# Altium project IM_v1.0.PrjPcb (part 2 of 2)

## Sheet MCU.SchDoc
size A3; SheetNumber: 4; SheetTotal: 8
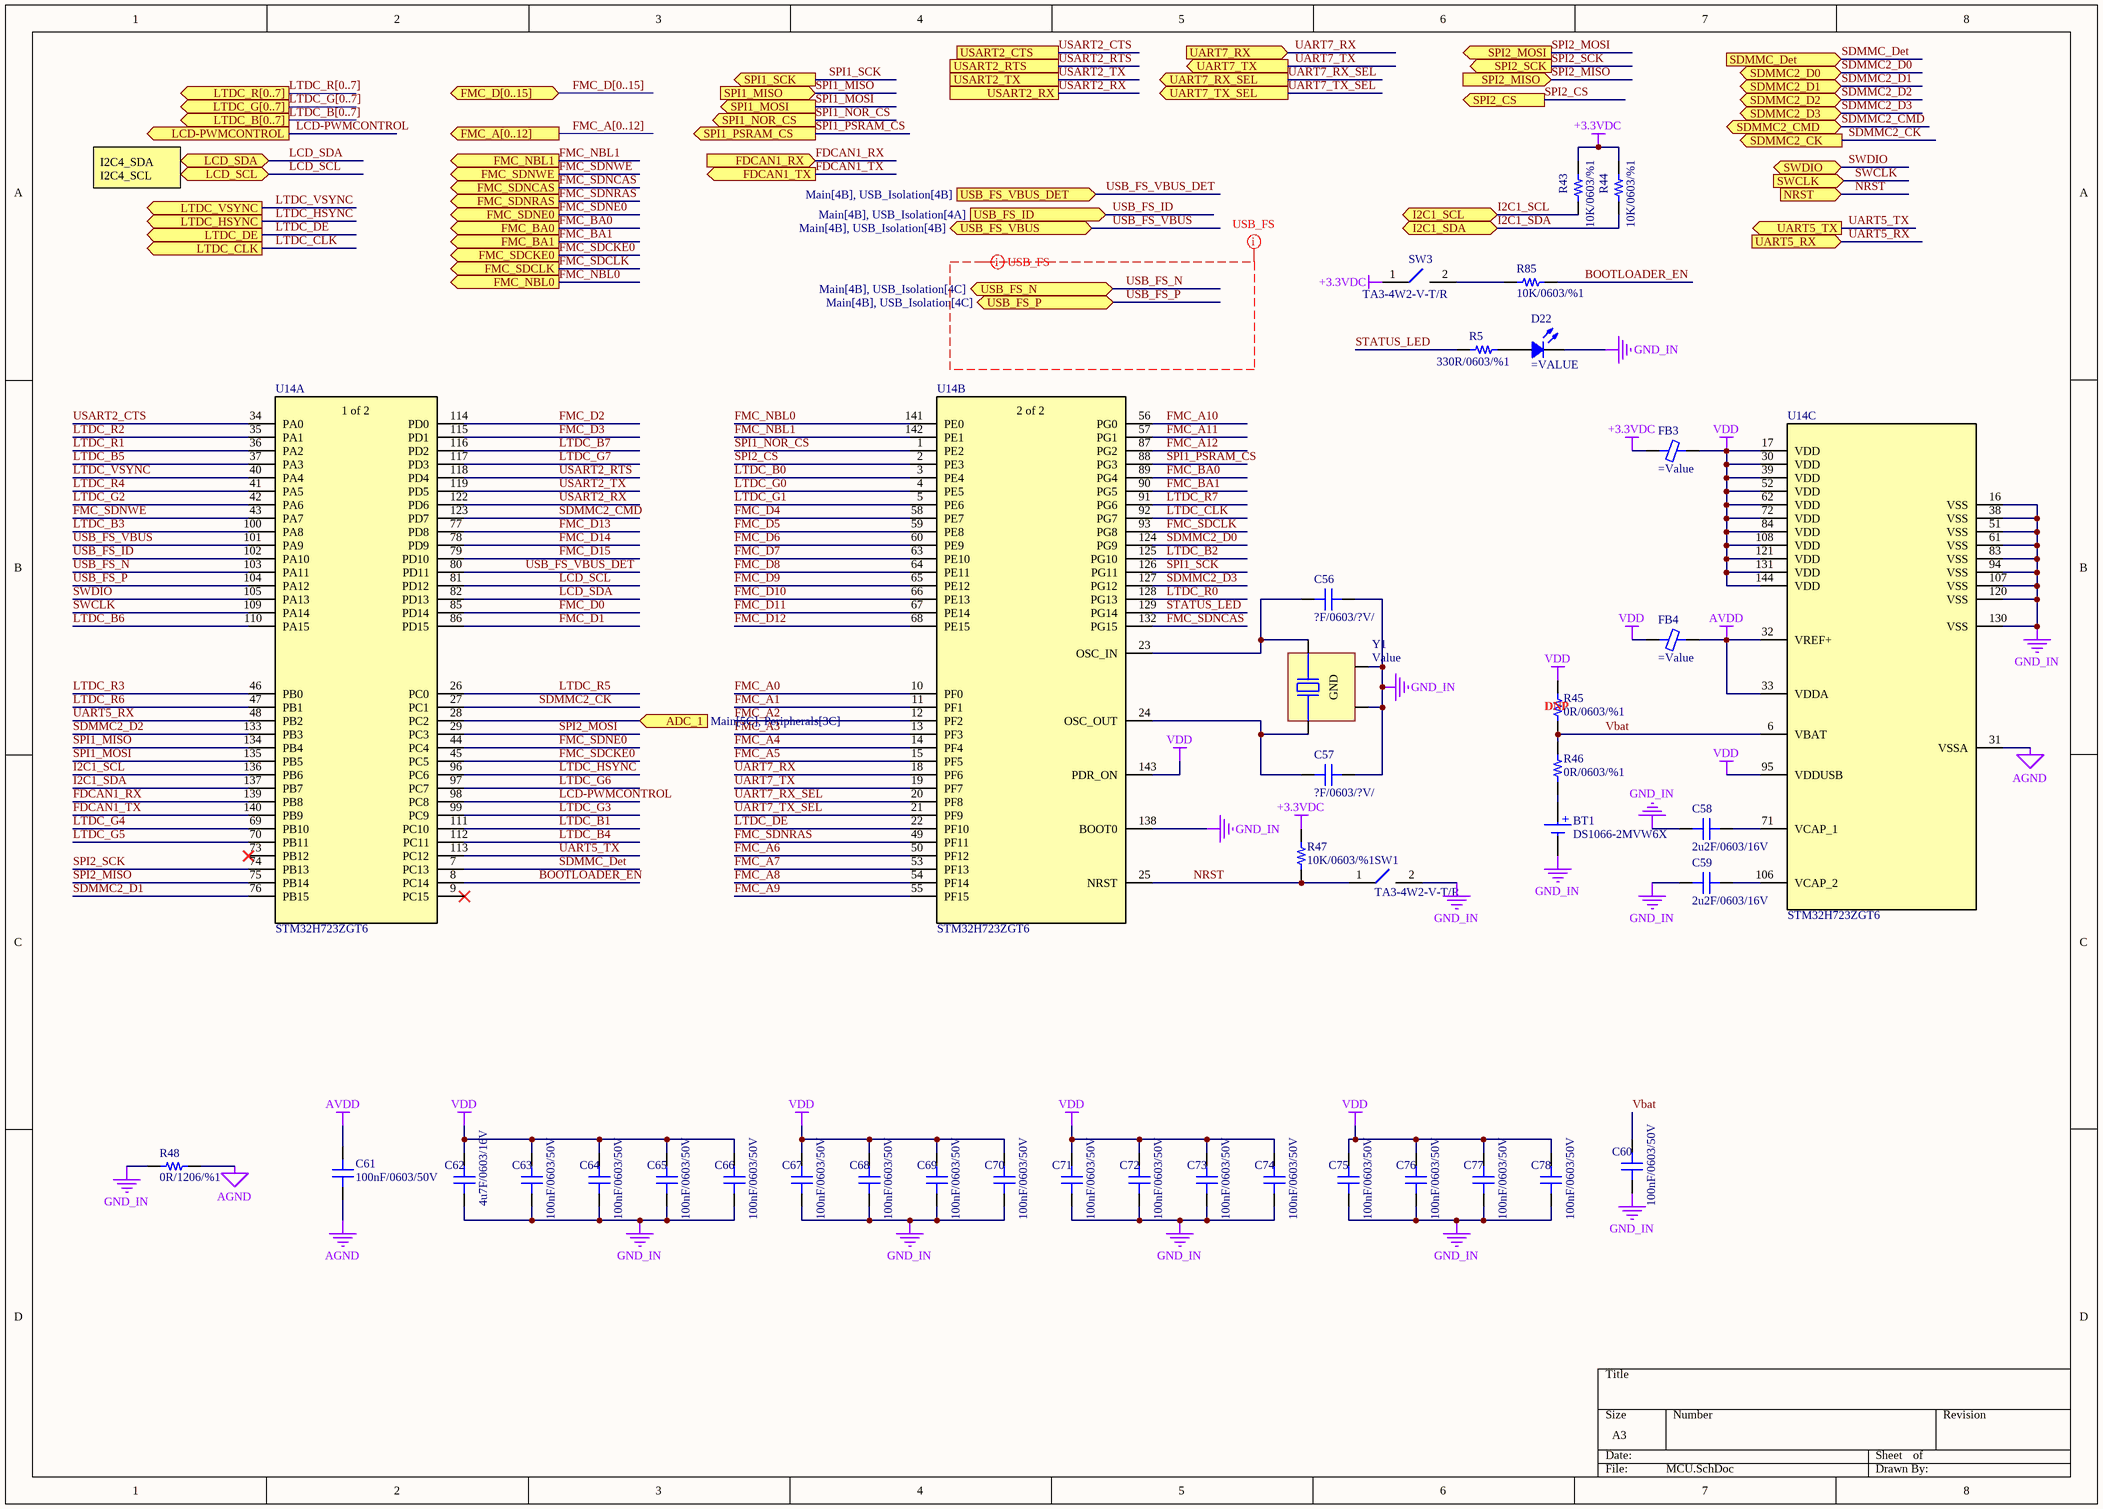
[diagram p7: MCU.SchDoc]

### Parts
(Parts that share a designator on the sheet are numbered #1, #2 ... from top to bottom, then left to right.)
BT1  DS1066-2MVW6X  [batt_conn]
C56  ?F/0603/?V/  [0603_cap]
C57  ?F/0603/?V/  [0603_cap]
C58  2u2F/0603/16V  [0603_cap]
C59  2u2F/0603/16V  [0603_cap]
C60  100nF/0603/50V  [0603_cap]
C61  100nF/0603/50V  [0603_cap]
C62  4u7F/0603/16V  [0603_cap]
C63  100nF/0603/50V  [0603_cap]
C64  100nF/0603/50V  [0603_cap]
C65  100nF/0603/50V  [0603_cap]
C66  100nF/0603/50V  [0603_cap]
C67  100nF/0603/50V  [0603_cap]
C68  100nF/0603/50V  [0603_cap]
C69  100nF/0603/50V  [0603_cap]
C70  100nF/0603/50V  [0603_cap]
C71  100nF/0603/50V  [0603_cap]
C72  100nF/0603/50V  [0603_cap]
C73  100nF/0603/50V  [0603_cap]
C74  100nF/0603/50V  [0603_cap]
C75  100nF/0603/50V  [0603_cap]
C76  100nF/0603/50V  [0603_cap]
C77  100nF/0603/50V  [0603_cap]
C78  100nF/0603/50V  [0603_cap]
D22  (no value)  [LED 0603_1608 GREEN]
FB3  (no value)  [0805_ferrite]
FB4  (no value)  [0805_ferrite]
R5#2  330R/0603/%1  [0603_res]
R43  10K/0603/%1  [0603_res]
R44  10K/0603/%1  [0603_res]
R45  0R/0603/%1  Assembly: DNP  [0603_res]
R46  0R/0603/%1  [0603_res]
R47  10K/0603/%1  [0603_res]
R48  0R/1206/%1  [1206_res]
R85  10K/0603/%1  [0603_res]
SW1  TA3-4W2-V-T/R  [SW_SMD_R/A]
SW3  TA3-4W2-V-T/R  [SW_SMD_R/A]
U14  STM32H723ZGT6  [ST LQFP-144 20X20MM]  (parts A,B,C of 3)
Y1  Value  [SMD4-Nolead]

### Ports
ADC_1 (in, see Main[5C], Peripherals[3C]), FDCAN1_RX (in, see Main[5B], Interfaces_Isolation[2C]), FDCAN1_TX (out, see Main[5B], Interfaces_Isolation[2C]), FMC_A[0..12] (out, see Main[4B], Memory[1A]), FMC_BA0 (out, see Main[4C], Memory[1C]), FMC_BA1 (out, see Main[4C], Memory[1C]), FMC_D[0..15] (bidir, see Main[4B], Memory[1A]), FMC_NBL0 (out, see Main[4C], Memory[1C]), FMC_NBL1 (out, see Main[4C], Memory[1B]), FMC_SDCKE0 (out, see Main[4C], Memory[1C]), FMC_SDCLK (out, see Main[4C], Memory[1C]), FMC_SDNCAS (out, see Main[4C], Memory[1B]), FMC_SDNE0 (out, see Main[4C], Memory[1C]), FMC_SDNRAS (out, see Main[4C], Memory[1B]), FMC_SDNWE (out, see Main[4C], Memory[1B]), I2C1_SCL (bidir, see Main[5A], Interfaces_Isolation[2A]), I2C1_SDA (bidir, see Main[5A], Interfaces_Isolation[2A]), LCD-PWMCONTROL (out, see Main[4D], LCD[1B]), LCD_SCL (bidir, see Main[4D], LCD[1B], Peripherals[1A]), LCD_SDA (bidir, see Main[4D], LCD[1B], Peripherals[1A]), LTDC_B[0..7] (out, see Main[4D], LCD[1C]), LTDC_CLK (out, see Main[4D], LCD[1B]), LTDC_DE (out, see Main[4D], LCD[1B]), LTDC_G[0..7] (out, see Main[4D], LCD[1C]), LTDC_HSYNC (out, see Main[4D], LCD[1B]), LTDC_R[0..7] (out, see Main[4D], LCD[1C]), LTDC_VSYNC (out, see Main[4D], LCD[1B]), NRST (in, see Main[5C], Peripherals[4B]), SDMMC2_CK (out, see Main[5C], Peripherals[1C]), SDMMC2_CMD (bidir, see Main[5C], Peripherals[1C]), SDMMC2_D0 (bidir, see Main[5C], Peripherals[1C]), SDMMC2_D1 (bidir, see Main[5C], Peripherals[1C]), SDMMC2_D2 (bidir, see Main[5C], Peripherals[1C]), SDMMC2_D3 (bidir, see Main[5C], Peripherals[1C]), SDMMC_Det (in, see Main[5C], Peripherals[2D]), SPI1_MISO (in, see Main[4C], Memory[2B]), SPI1_MOSI (out, see Main[4C], Memory[4B]), SPI1_NOR_CS (out, see Main[4C], Memory[2A]), SPI1_PSRAM_CS (out, see Main[4C], Memory[2C]), SPI1_SCK (out, see Main[4C], Memory[4B]), SPI2_CS (out, see Main[5B], Interfaces_Isolation[2A]), SPI2_MISO (in, see Main[5A], Interfaces_Isolation[2B]), SPI2_MOSI (out, see Main[5A], Interfaces_Isolation[2A]), SPI2_SCK (out, see Main[5A], Interfaces_Isolation[2A]), SWCLK (in, see Main[5C], Peripherals[4A]), SWDIO (bidir, see Main[5C], Peripherals[4A]), UART5_RX (in, see Main[5C], Peripherals[3B]), UART5_TX (out, see Main[5C], Peripherals[4B]), UART7_RX (in, see Main[5B], Interfaces_Isolation[1D]), UART7_RX_SEL (out, see Main[5B], Interfaces_Isolation[1D]), UART7_TX (out, see Main[5B], Interfaces_Isolation[1D]), UART7_TX_SEL (out, see Main[5B], Interfaces_Isolation[1D]), USART2_CTS (see Main[5A], Interfaces_Isolation[2B]), USART2_RTS (see Main[5B], Interfaces_Isolation[2B]), USART2_RX (see Main[5B], Interfaces_Isolation[2B]), USART2_TX (see Main[5B], Interfaces_Isolation[2B]), USB_FS_ID (in, see Main[4B], USB_Isolation[4A]), USB_FS_N (bidir, see Main[4B], USB_Isolation[4C]), USB_FS_P (bidir, see Main[4B], USB_Isolation[4C]), USB_FS_VBUS (bidir, see Main[4B], USB_Isolation[4B]), USB_FS_VBUS_DET (in, see Main[4B], USB_Isolation[4B])

### Nets
+3.3VDC: FB3.1 R43.1 R44.1 R47.1 SW3.1
AGND: C61.2 R48.1 U14.31(VSSA)
AVDD: C61.1 FB4.2 U14.32(VREF+) U14.33(VDDA)
GND_IN: BT1.2(-) C56.2 C57.2 C58.2 C59.2 C60.2 C62.1 C63.2 C64.2 C65.2 C66.2 C67.2 C68.2 C69.2 C70.2 C71.2 C72.2 C73.2 C74.2 C75.2 C76.2 C77.2 C78.2 D22.2 R48.2 SW1.2 U14.16(VSS) U14.38(VSS) U14.51(VSS) U14.61(VSS) U14.83(VSS) U14.94(VSS) U14.107(VSS) U14.120(VSS) U14.130(VSS) U14.138(BOOT0) Y1.2(GND) Y1.4(GND)
VDD: C62.2 C63.1 C64.1 C65.1 C66.1 C67.1 C68.1 C69.1 C70.1 C71.1 C72.1 C73.1 C74.1 C75.1 C76.1 C77.1 C78.1 FB3.2 FB4.1 R45.1 U14.17(VDD) U14.30(VDD) U14.39(VDD) U14.52(VDD) U14.62(VDD) U14.72(VDD) U14.84(VDD) U14.95(VDDUSB) U14.108(VDD) U14.121(VDD) U14.131(VDD) U14.143(PDR_ON) U14.144(VDD)
ADC_1: U14.28(PC2) ; port ADC_1
BOOTLOADER_EN: R85.2 U14.8(PC14)
FDCAN1_RX: U14.139(PB8) ; port FDCAN1_RX
FDCAN1_TX: U14.140(PB9) ; port FDCAN1_TX
FMC_A0: U14.10(PF0)
FMC_A1: U14.11(PF1)
FMC_A2: U14.12(PF2)
FMC_A3: U14.13(PF3)
FMC_A4: U14.14(PF4)
FMC_A5: U14.15(PF5)
FMC_A6: U14.50(PF12)
FMC_A7: U14.53(PF13)
FMC_A8: U14.54(PF14)
FMC_A9: U14.55(PF15)
FMC_A10: U14.56(PG0)
FMC_A11: U14.57(PG1)
FMC_A12: U14.87(PG2)
FMC_BA0: U14.89(PG4) ; port FMC_BA0
FMC_BA1: U14.90(PG5) ; port FMC_BA1
FMC_D0: U14.85(PD14)
FMC_D1: U14.86(PD15)
FMC_D2: U14.114(PD0)
FMC_D3: U14.115(PD1)
FMC_D4: U14.58(PE7)
FMC_D5: U14.59(PE8)
FMC_D6: U14.60(PE9)
FMC_D7: U14.63(PE10)
FMC_D8: U14.64(PE11)
FMC_D9: U14.65(PE12)
FMC_D10: U14.66(PE13)
FMC_D11: U14.67(PE14)
FMC_D12: U14.68(PE15)
FMC_D13: U14.77(PD8)
FMC_D14: U14.78(PD9)
FMC_D15: U14.79(PD10)
FMC_NBL0: U14.141(PE0) ; port FMC_NBL0
FMC_NBL1: U14.142(PE1) ; port FMC_NBL1
FMC_SDCKE0: U14.45(PC5) ; port FMC_SDCKE0
FMC_SDCLK: U14.93(PG8) ; port FMC_SDCLK
FMC_SDNCAS: U14.132(PG15) ; port FMC_SDNCAS
FMC_SDNE0: U14.44(PC4) ; port FMC_SDNE0
FMC_SDNRAS: U14.49(PF11) ; port FMC_SDNRAS
FMC_SDNWE: U14.43(PA7) ; port FMC_SDNWE
I2C1_SCL: R43.2 U14.136(PB6) ; port I2C1_SCL
I2C1_SDA: R44.2 U14.137(PB7) ; port I2C1_SDA
LCD-PWMCONTROL: U14.98(PC8) ; port LCD-PWMCONTROL
LCD_SCL: U14.81(PD12) ; port LCD_SCL
LCD_SDA: U14.82(PD13) ; port LCD_SDA
LTDC_B0: U14.3(PE4)
LTDC_B1: U14.111(PC10)
LTDC_B2: U14.125(PG10)
LTDC_B3: U14.100(PA8)
LTDC_B4: U14.112(PC11)
LTDC_B5: U14.37(PA3)
LTDC_B6: U14.110(PA15)
LTDC_B7: U14.116(PD2)
LTDC_CLK: U14.92(PG7) ; port LTDC_CLK
LTDC_DE: U14.22(PF10) ; port LTDC_DE
LTDC_G0: U14.4(PE5)
LTDC_G1: U14.5(PE6)
LTDC_G2: U14.42(PA6)
LTDC_G3: U14.99(PC9)
LTDC_G4: U14.69(PB10)
LTDC_G5: U14.70(PB11)
LTDC_G6: U14.97(PC7)
LTDC_G7: U14.117(PD3)
LTDC_HSYNC: U14.96(PC6) ; port LTDC_HSYNC
LTDC_R0: U14.128(PG13)
LTDC_R1: U14.36(PA2)
LTDC_R2: U14.35(PA1)
LTDC_R3: U14.46(PB0)
LTDC_R4: U14.41(PA5)
LTDC_R5: U14.26(PC0)
LTDC_R6: U14.47(PB1)
LTDC_R7: U14.91(PG6)
LTDC_VSYNC: U14.40(PA4) ; port LTDC_VSYNC
NRST: R47.2 SW1.1 U14.25(NRST) ; port NRST
SDMMC2_CK: U14.27(PC1) ; port SDMMC2_CK
SDMMC2_CMD: U14.123(PD7) ; port SDMMC2_CMD
SDMMC2_D0: U14.124(PG9) ; port SDMMC2_D0
SDMMC2_D1: U14.76(PB15) ; port SDMMC2_D1
SDMMC2_D2: U14.133(PB3) ; port SDMMC2_D2
SDMMC2_D3: U14.127(PG12) ; port SDMMC2_D3
SDMMC_Det: U14.7(PC13) ; port SDMMC_Det
SPI1_MISO: U14.134(PB4) ; port SPI1_MISO
SPI1_MOSI: U14.135(PB5) ; port SPI1_MOSI
SPI1_NOR_CS: U14.1(PE2) ; port SPI1_NOR_CS
SPI1_PSRAM_CS: U14.88(PG3) ; port SPI1_PSRAM_CS
SPI1_SCK: U14.126(PG11) ; port SPI1_SCK
SPI2_CS: U14.2(PE3) ; port SPI2_CS
SPI2_MISO: U14.75(PB14) ; port SPI2_MISO
SPI2_MOSI: U14.29(PC3) ; port SPI2_MOSI
SPI2_SCK: U14.74(PB13) ; port SPI2_SCK
STATUS_LED: R5#2.2 U14.129(PG14)
SWCLK: U14.109(PA14) ; port SWCLK
SWDIO: U14.105(PA13) ; port SWDIO
UART5_RX: U14.48(PB2) ; port UART5_RX
UART5_TX: U14.113(PC12) ; port UART5_TX
UART7_RX: U14.18(PF6) ; port UART7_RX
UART7_RX_SEL: U14.20(PF8) ; port UART7_RX_SEL
UART7_TX: U14.19(PF7) ; port UART7_TX
UART7_TX_SEL: U14.21(PF9) ; port UART7_TX_SEL
USART2_CTS: U14.34(PA0) ; port USART2_CTS
USART2_RTS: U14.118(PD4) ; port USART2_RTS
USART2_RX: U14.122(PD6) ; port USART2_RX
USART2_TX: U14.119(PD5) ; port USART2_TX
USB_FS_ID: U14.102(PA10) ; port USB_FS_ID
USB_FS_N: U14.103(PA11) ; port USB_FS_N
USB_FS_P: U14.104(PA12) ; port USB_FS_P
USB_FS_VBUS: U14.101(PA9) ; port USB_FS_VBUS
USB_FS_VBUS_DET: U14.80(PD11) ; port USB_FS_VBUS_DET
Vbat: C60.1 R45.2 R46.1 U14.6(VBAT)
NetBT1_1: BT1.1(+) R46.2
NetC56_1: C56.1 U14.23(OSC_IN) Y1.3
NetC57_1: C57.1 U14.24(OSC_OUT) Y1.1
NetC58_1: C58.1 U14.71(VCAP_1)
NetC59_1: C59.1 U14.106(VCAP_2)
NetD22_1: D22.1 R5#2.1
NetR85_1: R85.1 SW3.2

Not connected (* = marked no-connect by the designer): U14 9(PC15)* 73(PB12)*

### Buses and harness runs
bus FMC_A[0..12] = port FMC_A[0..12]
bus FMC_D[0..15] = port FMC_D[0..15]
bus LTDC_B[0..7] = port LTDC_B[0..7]
bus LTDC_G[0..7] = port LTDC_G[0..7]
bus LTDC_R[0..7] = port LTDC_R[0..7]

### Layout directives
differential pair: USB_FS_N, USB_FS_P
mark named USB_FS: USB_FS_N, USB_FS_P

### Notes on the sheet
- I2C4_SDA
  I2C4_SCL
- (in symbol STM32H723ZGT6, part A) 1 of 2
- (in symbol STM32H723ZGT6, part B) 2 of 2

### Library data of the parts
BT1 = battery_conn: Assembly: .; Value: DS1066-2MVW6X; PN: DS1066-2MVW6X; HelpURL: https://www.ozdisan.com/p/pcb-konnektorler-310/connfly-ds1066-2mvw6x-423540
C56-C78 = Capacitor: HelpURL: *; PN: *; Assembly: *
  C56 C57: Value: ?F/0603/?V/
  C58 C59: Value: 2u2F/0603/16V
  C60 C61 C63-C78: Value: 100nF/0603/50V
  C62: Value: 4u7F/0603/16V
D22 = LED: Chip LED
FB3 FB4 = Ferrite Chip: SMT Ferrite Chip
R5#2 R43 R44 R46-R48 R85 = RES: Assembly: .; HelpURL: *; PN: *
  R5#2: Value: 330R/0603/%1
  R43 R44 R47 R85: Value: 10K/0603/%1
  R46: Value: 0R/0603/%1
  R48: Value: 0R/1206/%1
R45 = RES: HelpURL: *; PN: *; Value: 0R/0603/%1
SW1 SW3 = SPST-R/A: SWITCH TACT 6.00x6.00 7.00mm 180gF THT R/A; Manufacturer: KLS ELECTRONIC; Assembly: .; Help URL: https://www.ozdisan.com/p/tact-sivicler-485/kls-electronic-l-kls7-ts6606-7-0-180-459003; PN: TA3-4W2-V-T/R; Value: TA3-4W2-V-T/R
U14 = STM32H723ZGT6: ARM® Cortex®-M7 STM32H7 Microcontroller IC 32-Bit 550MHz 1MB (1M x 8) FLASH 144-LQFP (20x20); Assembly: .; Value: STM32H723ZGT6; PN: STM32H723ZGT6; HelpURL: https://www.digikey.com/en/products/detail/stmicroelectronics/STM32H723ZGT6/13171205
Y1 = Crystal(4-SMD): 25 MHz ±10ppm Crystal 10pF 50 Ohms 4-SMD, No Lead; Value: ABM8-25.000MHZ-10-D1G-T; Assembly: .; PN: ABM8-25.000MHZ-10-D1G-T; HelpURL: https://www.digikey.com/en/products/detail/abracon-llc/ABM8-25-000MHZ-10-D1G-T/5980064?s=N4IgTCBcDaIIICECyAOAtGArAOgAz6QAkAtNARlzQBEyBxNAFRAF0BfIA

## Nets that join several sheets
+3.3V_ISO: Interfaces_Isolation (6 pins), System_Power (C16#2.2 C100.2 TP13.1 U22.5)
+3.3VDC: Interfaces_Isolation (22 pins), LCD (J9.4), Memory (23 pins), Peripherals (16 pins), System_Power (6 pins), USB_Isolation (5 pins), MCU (5 pins)
+3.3VUSB_FILT: System_Power (C20.2 C21.2 TP5.1 U4.5), USB_Isolation (5 pins)
+5VDC: LCD (J9.1 J9.2), System_Power (7 pins), USB_Isolation (R87.1)
+5VISO: Interfaces_Isolation (6 pins), System_Power (8 pins)
+5VUSB_FILT: System_Power (8 pins), USB_Isolation (5 pins)
GND_IN: Main (R82.2 R83.2 R84.2), Interfaces_Isolation (24 pins), LCD (J9.3 J9.6 J9.39 J9.40), Memory (19 pins), Peripherals (16 pins), System_Power (24 pins), USB_Isolation (11 pins), MCU (38 pins)
SGN_GND: Main (R82.1 R83.1 R84.1), Interfaces_Isolation (50 pins), System_Power (8 pins)
USB_GND: System_Power (11 pins), USB_Isolation (22 pins)
ADC_1: Peripherals (R74.2 R75.1), MCU (U14.28)
FDCAN1_RX: Interfaces_Isolation (U9.3), MCU (U14.139)
FDCAN1_TX: Interfaces_Isolation (U9.2), MCU (U14.140)
FMC_A0: Memory (U15.23), MCU (U14.10)
FMC_A1: Memory (U15.24), MCU (U14.11)
FMC_A2: Memory (U15.25), MCU (U14.12)
FMC_A3: Memory (U15.26), MCU (U14.13)
FMC_A4: Memory (U15.29), MCU (U14.14)
FMC_A5: Memory (U15.30), MCU (U14.15)
FMC_A6: Memory (U15.31), MCU (U14.50)
FMC_A7: Memory (U15.32), MCU (U14.53)
FMC_A8: Memory (U15.33), MCU (U14.54)
FMC_A9: Memory (U15.34), MCU (U14.55)
FMC_A10: Memory (U15.22), MCU (U14.56)
FMC_A11: Memory (U15.35), MCU (U14.57)
FMC_A12: Memory (U15.36), MCU (U14.87)
FMC_BA0: Memory (U15.20), MCU (U14.89)
FMC_BA1: Memory (U15.21), MCU (U14.90)
FMC_D0: Memory (U15.2), MCU (U14.85)
FMC_D1: Memory (U15.4), MCU (U14.86)
FMC_D2: Memory (U15.5), MCU (U14.114)
FMC_D3: Memory (U15.7), MCU (U14.115)
FMC_D4: Memory (U15.8), MCU (U14.58)
FMC_D5: Memory (U15.10), MCU (U14.59)
FMC_D6: Memory (U15.11), MCU (U14.60)
FMC_D7: Memory (U15.13), MCU (U14.63)
FMC_D8: Memory (U15.42), MCU (U14.64)
FMC_D9: Memory (U15.44), MCU (U14.65)
FMC_D10: Memory (U15.45), MCU (U14.66)
FMC_D11: Memory (U15.47), MCU (U14.67)
FMC_D12: Memory (U15.48), MCU (U14.68)
FMC_D13: Memory (U15.50), MCU (U14.77)
FMC_D14: Memory (U15.51), MCU (U14.78)
FMC_D15: Memory (U15.53), MCU (U14.79)
FMC_NBL0: Memory (U15.39), MCU (U14.141)
FMC_NBL1: Memory (U15.15), MCU (U14.142)
FMC_SDCKE0: Memory (U15.37), MCU (U14.45)
FMC_SDCLK: Memory (U15.38), MCU (U14.93)
FMC_SDNCAS: Memory (U15.17), MCU (U14.132)
FMC_SDNE0: Memory (U15.19), MCU (U14.44)
FMC_SDNRAS: Memory (U15.18), MCU (U14.49)
FMC_SDNWE: Memory (U15.16), MCU (U14.43)
I2C1_SCL: Interfaces_Isolation (R14.2 U5.3), MCU (R43.2 U14.136)
I2C1_SDA: Interfaces_Isolation (R12.1 U5.2), MCU (R44.2 U14.137)
LCD-PWMCONTROL: LCD (J9.20), MCU (U14.98)
LCD_SCL: LCD (J9.16), Peripherals (R78.1 R81.2 U21.2), MCU (U14.81)
LCD_SDA: LCD (J9.18), Peripherals (R79.1 R80.2 U21.1), MCU (U14.82)
LTDC_B0: LCD (J9.8), MCU (U14.3)
LTDC_B1: LCD (J9.15), MCU (U14.111)
LTDC_B2: LCD (J9.7), MCU (U14.125)
LTDC_B3: LCD (J9.19), MCU (U14.100)
LTDC_B4: LCD (J9.17), MCU (U14.112)
LTDC_B5: LCD (J9.32), MCU (U14.37)
LTDC_B6: LCD (J9.13), MCU (U14.110)
LTDC_B7: LCD (J9.11), MCU (U14.116)
LTDC_CLK: LCD (J9.27), MCU (U14.92)
LTDC_DE: LCD (J9.24), MCU (U14.22)
LTDC_G0: LCD (J9.10), MCU (U14.4)
LTDC_G1: LCD (J9.12), MCU (U14.5)
LTDC_G2: LCD (J9.38), MCU (U14.42)
LTDC_G3: LCD (J9.21), MCU (U14.99)
LTDC_G4: LCD (J9.35), MCU (U14.69)
LTDC_G5: LCD (J9.37), MCU (U14.70)
LTDC_G6: LCD (J9.23), MCU (U14.97)
LTDC_G7: LCD (J9.9), MCU (U14.117)
LTDC_HSYNC: LCD (J9.25), MCU (U14.96)
LTDC_R0: LCD (J9.5), MCU (U14.128)
LTDC_R1: LCD (J9.30), MCU (U14.36)
LTDC_R2: LCD (J9.28), MCU (U14.35)
LTDC_R3: LCD (J9.31), MCU (U14.46)
LTDC_R4: LCD (J9.36), MCU (U14.41)
LTDC_R5: LCD (J9.26), MCU (U14.26)
LTDC_R6: LCD (J9.33), MCU (U14.47)
LTDC_R7: LCD (J9.29), MCU (U14.91)
LTDC_VSYNC: LCD (J9.34), MCU (U14.40)
NRST: Peripherals (J11.12), MCU (R47.2 SW1.1 U14.25)
SDMMC2_CK: Peripherals (CN1.5), MCU (U14.27)
SDMMC2_CMD: Peripherals (CN1.3 R71.2), MCU (U14.123)
SDMMC2_D0: Peripherals (CN1.7 R70.2), MCU (U14.124)
SDMMC2_D1: Peripherals (CN1.8 R69.2), MCU (U14.76)
SDMMC2_D2: Peripherals (CN1.1 R73.2), MCU (U14.133)
SDMMC2_D3: Peripherals (CN1.2 R72.2), MCU (U14.127)
SDMMC_Det: Peripherals (R76.1), MCU (U14.7)
SPI1_MISO: Memory (R52.1 U17.2), MCU (U14.134)
SPI1_MOSI: Memory (R54.2 U17.5), MCU (U14.135)
SPI1_NOR_CS: Memory (R51.2 U16.1), MCU (U14.1)
SPI1_PSRAM_CS: Memory (R55.2 U17.1), MCU (U14.88)
SPI1_SCK: Memory (R53.2 U17.6), MCU (U14.126)
SPI2_CS: Interfaces_Isolation (R16.2), MCU (U14.2)
SPI2_MISO: Interfaces_Isolation (R22.2), MCU (U14.75)
SPI2_MOSI: Interfaces_Isolation (R20.2), MCU (U14.29)
SPI2_SCK: Interfaces_Isolation (R18.2), MCU (U14.74)
SWCLK: Peripherals (R63.1), MCU (U14.109)
SWDIO: Peripherals (R62.1), MCU (U14.105)
UART5_RX: Peripherals (R64.2), MCU (U14.48)
UART5_TX: Peripherals (R68.1), MCU (U14.113)
UART7_RX: Interfaces_Isolation (U11.10), MCU (U14.18)
UART7_RX_SEL: Interfaces_Isolation (U11.1), MCU (U14.20)
UART7_TX: Interfaces_Isolation (U11.6), MCU (U14.19)
UART7_TX_SEL: Interfaces_Isolation (U11.5), MCU (U14.21)
USART2_CTS: Interfaces_Isolation (R26.2), MCU (U14.34)
USART2_RTS: Interfaces_Isolation (R24.2), MCU (U14.118)
USART2_RX: Interfaces_Isolation (R30.2), MCU (U14.122)
USART2_TX: Interfaces_Isolation (R28.2), MCU (U14.119)
USB_D1_N: System_Power (5 pins), USB_Isolation (U20.8)
USB_D1_P: System_Power (5 pins), USB_Isolation (U20.2)
USB_FS_ID: USB_Isolation (SW2.1 U18.1), MCU (U14.102)
USB_FS_N: USB_Isolation (R94.1 TP11.1), MCU (U14.103)
USB_FS_P: USB_Isolation (R95.1 TP12.1), MCU (U14.104)
USB_FS_VBUS: USB_Isolation (R93.1), MCU (U14.101)
USB_FS_VBUS_DET: USB_Isolation (R88.2 R89.1), MCU (U14.80)